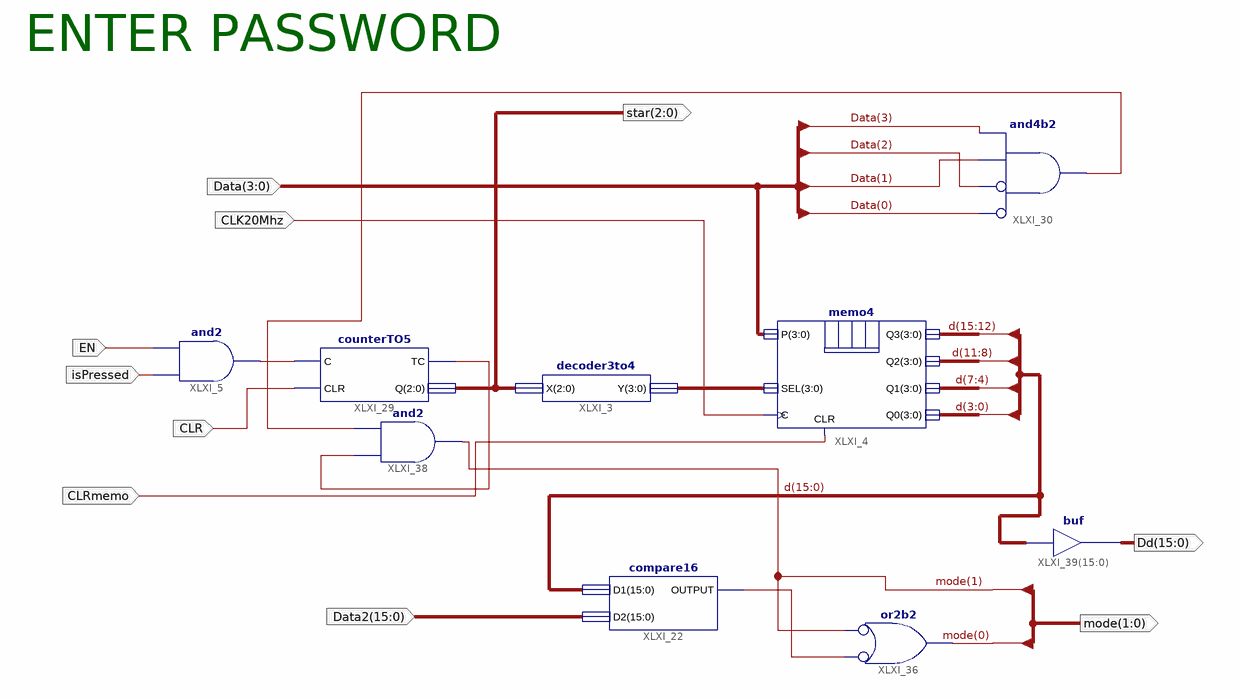
[diagram p0: schematic sheet 1]
// Xilinx ISE schematic ENTERPASS.sch (spartan6) as structural Verilog: 9 symbols, 10 ports
module ENTERPASS (
  input  [3:0] Data,
  input  CLK20Mhz,
  input  EN,
  input  isPressed,
  input  [15:0] Data2,
  input  CLRmemo,
  input  CLR,
  output [2:0] star,
  output [1:0] mode,
  output [15:0] Dd
);

  wire XLXN_6, XLXN_86, XLXN_88, XLXN_89;
  wire [3:0] XLXN_2;
  wire [15:0] d;

  decoder3to4 XLXI_3 (.X(star), .Y(XLXN_2));
  memo4 XLXI_4 (
    .Q3(d[15:12]), .Q2(d[11:8]), .Q1(d[7:4]), .Q0(d[3:0]), .P(Data), .C(CLK20Mhz), .CLR(CLRmemo), .SEL(XLXN_2));
  compare16 XLXI_22 (.D1(d), .D2(Data2), .OUTPUT(XLXN_86));
  and XLXI_5 (XLXN_6, isPressed, EN);
  counterTO5 XLXI_29 (.C(XLXN_6), .CLR(CLR), .TC(XLXN_89), .Q(star));
  and XLXI_30 (XLXN_88, ~Data[0], ~Data[2], Data[1], Data[3]);  // and4b2
  or XLXI_36 (mode[0], ~mode[1], ~XLXN_86);  // or2b2
  and XLXI_38 (mode[1], XLXN_89, XLXN_88);
  assign Dd = d;  // buf XLXI_39[15..0], 16 bits wide

  // Notes on the sheet:
  //   ENTER PASSWORD
endmodule
